# EAGLE design Clap operated system (EAGLE 9.6.2)
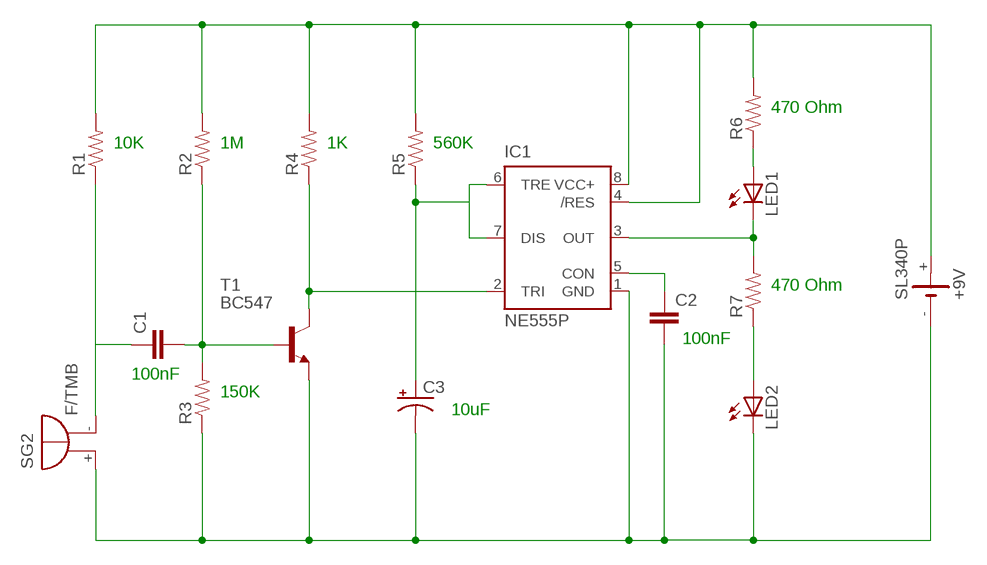
[diagram p0: schematic, sheet 1]

## Parts
+9V  SL340P  [SL-340/P3.6V]
C1  0.1UF-50V-20%(PTH)KIT-EZ  [CAP-PTH-SMALL-KIT]
C2  0.1UF-50V-20%(PTH)KIT-EZ  [CAP-PTH-SMALL-KIT]
C3  CAP_POLPTH1  [CPOL-RADIAL-100UF-25V]
IC1  NE555P  [DIL-08]
LED1  LED5MM  [LED5MM]
LED2  LED5MM  [LED5MM]
R1  10KOHM1/6W5%(PTH)KIT  [AXIAL-0.3-KIT]
R2  10KOHM1/6W5%(PTH)KIT  [AXIAL-0.3-KIT]
R3  10KOHM1/6W5%(PTH)KIT  [AXIAL-0.3-KIT]
R4  10KOHM1/6W5%(PTH)KIT  [AXIAL-0.3-KIT]
R5  10KOHM1/6W5%(PTH)KIT  [AXIAL-0.3-KIT]
R6  10KOHM1/6W5%(PTH)KIT  [AXIAL-0.3-KIT]
R7  10KOHM1/6W5%(PTH)KIT  [AXIAL-0.3-KIT]
SG2  F/TMB  [F/TMB]
T1  BC547  [TO92]

## Nets
N$1: C1.1 R1.P$1 SG2.-
N$2: C1.2 R2.P$1 R3.P$2 T1.2(B)
N$3: IC1.2(TRI) R4.P$1 T1.3(C)
N$4: C3.1(+) IC1.6(TRE) IC1.7(DIS) R5.P$1
N$5: C2.1 IC1.5(CON)
N$6: IC1.3(OUT) LED1.K(C) R7.P$2
N$7: LED2.A R7.P$1
N$8: +9V.+ IC1.4(/RES) IC1.8(VCC+) R1.P$2 R2.P$2 R4.P$2 R5.P$2 R6.P$2
N$9: LED1.A R6.P$1
N$10: +9V.- C2.2 C3.2(-) IC1.1(GND) LED2.K(C) R3.P$1 SG2.+ T1.1(E)

## Notes on the sheet
- 470 Ohm
- 10K | 1M | 1K | 560K
- 470 Ohm
- 100nF
- 100nF
- 150K
- 10uF

## Library data of the parts
+9V = battery:SL340P: LI BATTERY Sonnenschein SL-340 P 3.6 V
C1 C2 = SparkFun-Capacitors:0.1UF-50V-20%(PTH): CAP-08370; PROD_ID: CAP-08370
C3 = SparkFun-Capacitors:CAP_POL: Capacitor Polarized These are standard SMD and PTH capacitors. Normally 10uF, 47uF, and 100uF in electrolytic and tantalum varieties. Always verify the external diameter of the through hole cap, it varies with capacity, voltage, and manufacturer. The EIA devices should be standard.
IC1 = SparkFun-AnalogIC:NE555: General purpose bipolar Timer; MF: Arrow Electronics; MPN: NE555N; OC_FARNELL: 1467742; OC_NEWARK: 89K1486
LED1 LED2 = SparkFun-LED:LED: LEDs Standard schematic elements and footprints for 5mm, 3mm, 1206, and 0603 sized LEDs. 5mm - Spark Fun Electronics SKU : COM-00529 (and others)
R1-R7 = SparkFun-Resistors:10KOHM1/6W5%(PTH): RES-08375; PROD_ID: RES-08375
SG2 = buzzer:F/TMB: BUZZER Source: Buerklin; OC_FARNELL: unknown; OC_NEWARK: unknown
T1 = transistor:BC547: NPN TRANSISTOR

## Board
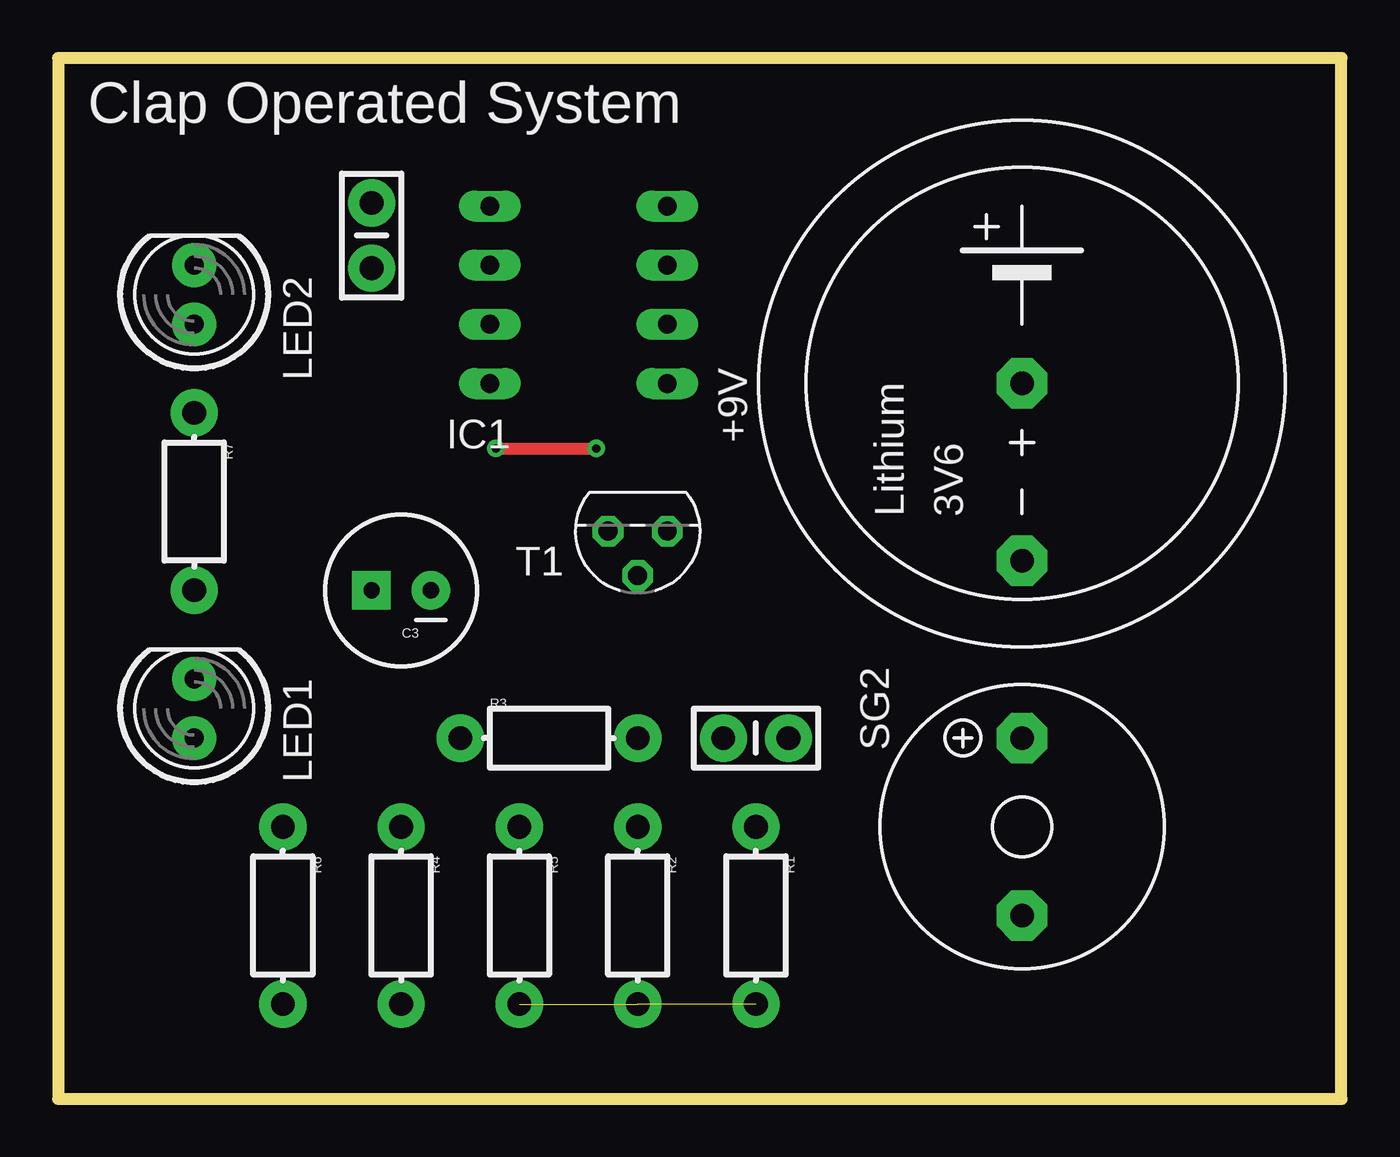
[diagram p1: board, top side]
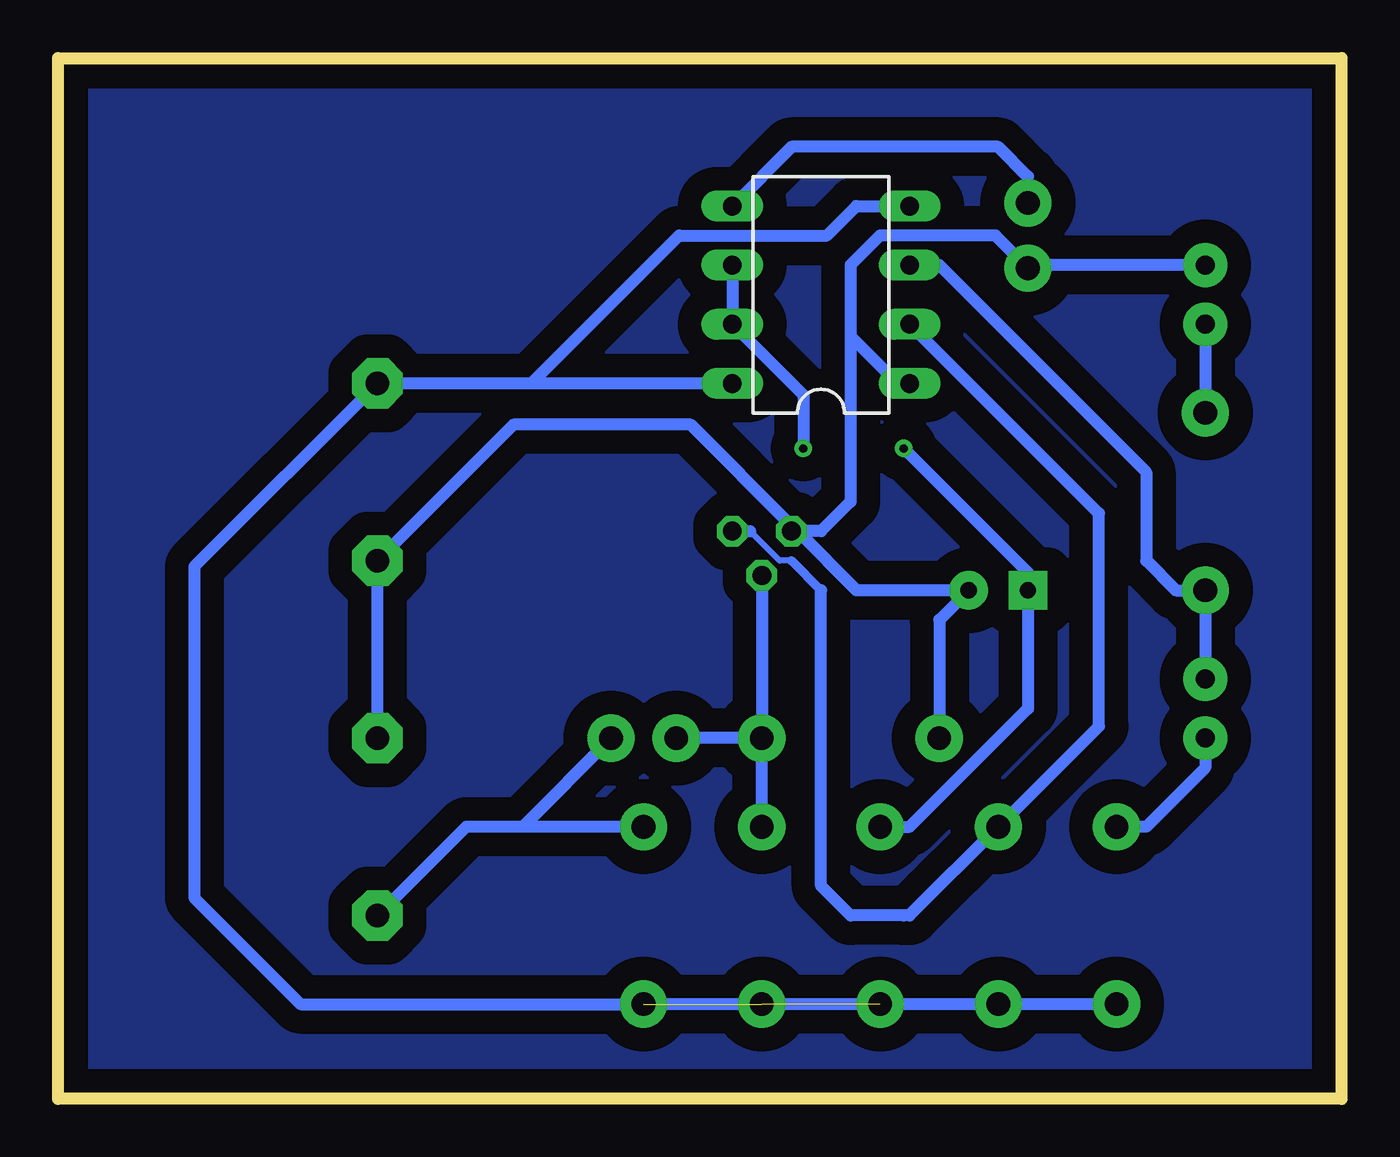
[diagram p2: board, bottom side, seen from below]

Size 55.12 x 44.7 mm. Coordinates in mm from the lower left corner, seen from the top.
Outline: 0,44.7 0,0 55.12,0 55.12,44.7 0,44.7
Copper layers (1*16): Top 0.035mm / dielectric 1.5mm / Bottom 0.035mm
Design rules "default": minimum track width 6mil, minimum drill 0.35mm, track to track 6mil, track to pad 6mil, pad to pad 6mil, via to via 6mil, smd to smd 6mil, copper to edge 40mil, drill to drill 6mil, minimum pad ring 10mil, minimum via ring 8mil, stop-mask expansion 4mil, vias tented up to drill 0mil, thermal gap 10mil

### Footprints (pad centres in the part's own frame; a part is rotated, then mirrored left to right if it is on the bottom)
SL-340/P3.6V = drill 1.016 pad 2.159 octagon: + 0,0; - -7.62,0
CAP-PTH-SMALL-KIT = drill 1.016 pad 2.032: 1 -1.397,0; 2 1.397,0
CPOL-RADIAL-100UF-25V = drill 0.7 pad 1.651 square: 1 1.27,0 | drill 0.7 pad 1.651: 2 -1.27,0
DIL-08 = drill 0.813 long: 1 -3.81,-3.81; 2 -1.27,-3.81; 3 1.27,-3.81; 4 3.81,-3.81; 5 3.81,3.81; 6 1.27,3.81; 7 -1.27,3.81; 8 -3.81,3.81
LED5MM = drill 0.813 pad 1.88: A -1.27,0; K 1.27,0
AXIAL-0.3-KIT = drill 1.016 pad 2.032: P$1 -3.81,0; P$2 3.81,0
F/TMB = drill 1.016 pad 2.159 octagon: + 3.81,0; - -3.81,0
TO92 = drill 0.813 octagon: 1 1.27,0; 2 0,1.905; 3 -1.27,0

### Placement (x,y rotation side)
+9V  41.4,30.73 90 top
C1  29.97,15.49 180 top
C2  13.46,37.08 270 top
C3  14.73,21.84 180 top
IC1  22.35,34.54 90 bottom
LED1  5.84,16.76 90 top
LED2  5.84,34.54 90 top
R1  29.97,7.87 270 top
R2  24.89,7.87 270 top
R3  21.08,15.49 0 top
R4  14.73,7.87 270 top
R5  19.81,7.87 270 top
R6  9.65,7.87 270 top
R7  5.84,25.65 270 top
SG2  41.4,11.68 90 top
T1  24.89,24.38 180 top

### Tracks (layer width: path | path; a pad name or v marks a point on that pad's centre or on a via)
GND
  pour Bottom (isolate 1.016): 0.76,43.94 0.76,1.02 54.1,1.02 54.1,43.94
N$1
  Bottom 0.508: R1.P$1 35.18,11.68 | SG2.- 37.59,11.68 35.18,11.68 | C1.1 35.18,11.68
N$2
  Bottom 0.508: R2.P$1 R3.P$2 | R3.P$2 C1.2 28.7,15.49 | T1.2 R3.P$2
N$3
  Bottom 0.254: 23.62,23.11 24.13,23.11 25.4,24.38
  Bottom 0.381: 22.35,21.84 23.62,23.11
  Bottom 0.508: 22.35,21.84 22.35,9.14 21.08,7.87 18.8,7.87 18.54,7.87 R4.P$1 10.41,16 10.41,25.15 IC1.2 18.54,33.53 18.8,33.53 | T1.3 25.4,24.38
N$4  (via drill 0.35)
  Top 0.508: v18.8,27.94 v23.11,27.94
  Bottom 0.508: IC1.6 IC1.7 23.11,30.23 v23.11,27.94 | R5.P$1 18.54,11.68 13.46,16.76 C3.1 13.46,22.61 v18.8,27.94
N$5
  Bottom 0.508: C2.1 13.46,39.62 14.73,40.89 23.62,40.89 IC1.5
N$6
  Bottom 0.508: R7.P$2 LED1.K | IC1.3 17.27,35.81 8.38,26.92 8.38,23.11 7.11,21.84 R7.P$2 | R7.P$2 6.1,21.59
N$7
  Bottom 0.508: LED2.A R7.P$1
N$8  (2 unrouted)
  Bottom 0.508: R6.P$2 R4.P$2 R1.P$2 | IC1.8 34.8,30.73 | 34.8,30.73 +9V.+ 49.28,22.86 49.28,8.64 44.7,4.06 R1.P$2 | R1.P$2 30.23,4.32 | 34.8,30.73 28.45,37.08 22.1,37.08 20.83,38.35 IC1.4
N$9
  Bottom 0.508: LED1.A 5.84,14.22 8.38,11.68 R6.P$1
N$10
  Bottom 0.508: LED2.K 13.33,35.81 C2.2 14.86,37.08 19.81,37.08 21.08,35.81 21.08,32.77 | SG2.+ +9V.- | R3.P$1 17.27,20.57 C3.2 20.83,21.84 23.37,24.38 T1.1 | 21.08,32.77 21.08,25.65 22.35,24.38 T1.1 | +9V.- 41.4,23.37 | T1.1 23.62,24.64 27.94,28.96 35.56,28.96 +9V.- | IC1.1 19.05,30.73 21.08,32.77

### Text on the board
tPlace: Clap Operated System